# Altium schematic sheet 电梯原理图.SchDoc
size A4
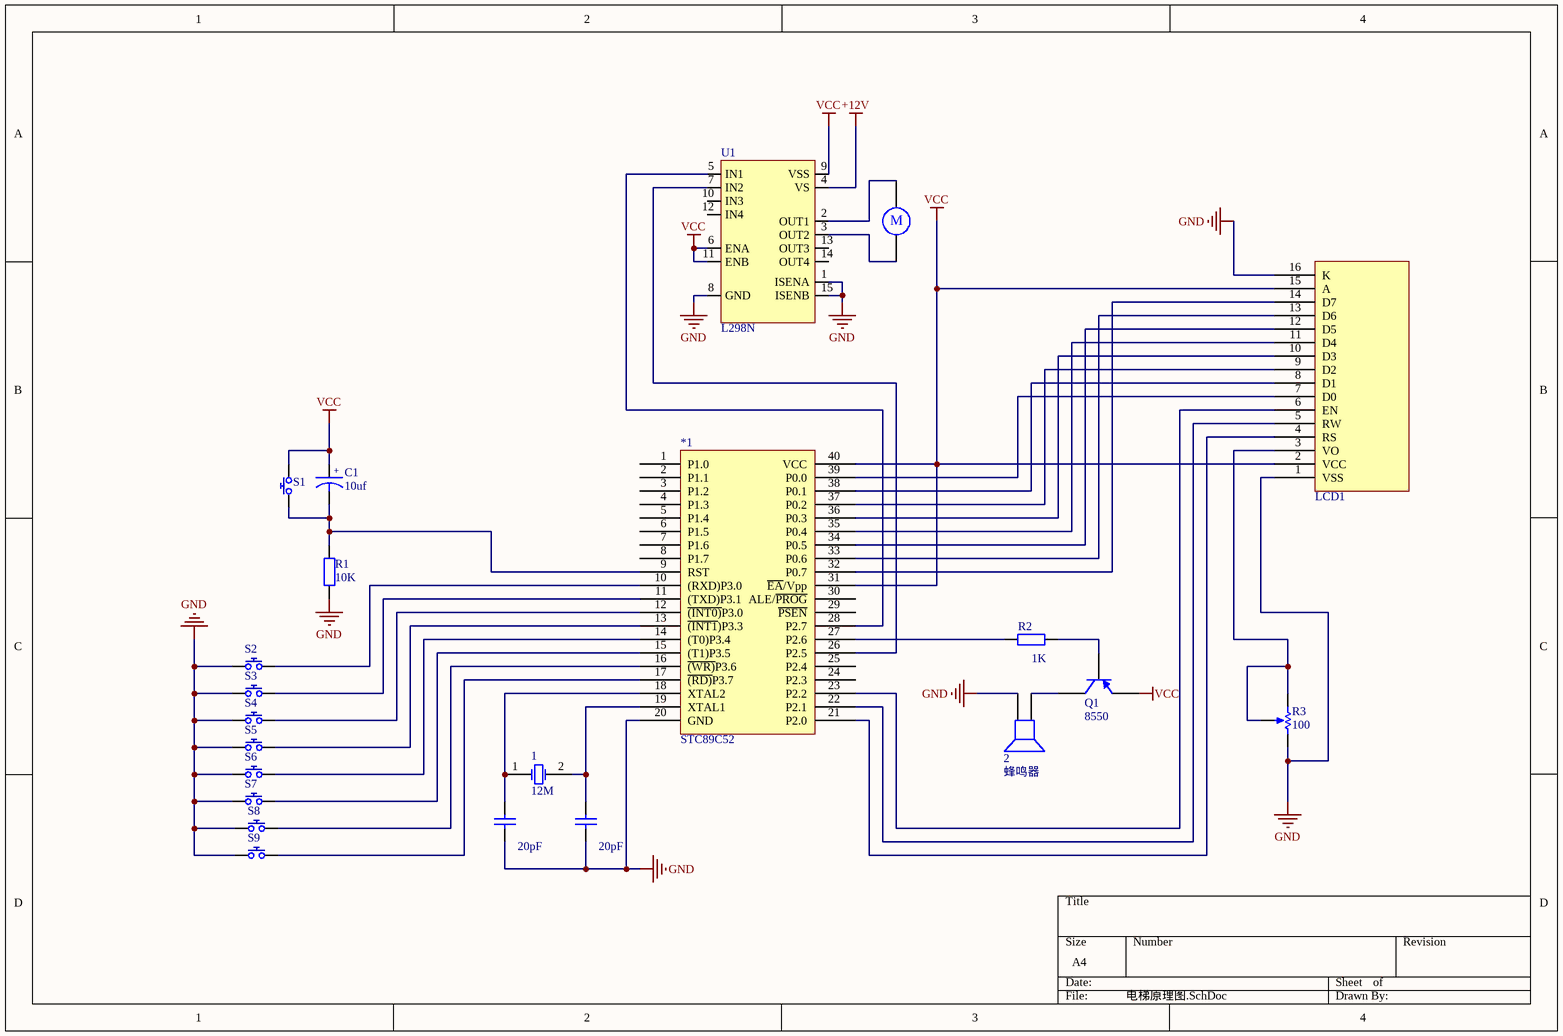
[diagram p0: 电梯原理图.SchDoc]

## Parts
1  12M  [BCY-W2/D3.1]
2  蜂鸣器  [PIN2]
*1  STC89C52
B1  Motor  [RB5-10.5]  (value not drawn)
C1  10uf  [RB.3/.6]
C2  value 20pF  [RAD-0.3]  (hidden comment: Cap)
C3  value 20pF  [RAD-0.3]  (hidden comment: Cap)
LCD1  Component_1  (value not drawn)
Q1  8550  [SOT-23B_N]
R1  10K  [R-AXIAL0.4]
R2  value 1K  [AXIAL-0.4]  (hidden comment: Res2)
R3  value 100  [VR5]  (hidden comment: RPot)
S1  (no value)  [KEY_4PIN]
S2  (no value)  [KEY_4PIN]
S3  (no value)  [KEY_4PIN]
S4  (no value)  [KEY_4PIN]
S5  (no value)  [KEY_4PIN]
S6  (no value)  [KEY_4PIN]
S7  (no value)  [KEY_4PIN]
S8  (no value)  [KEY_4PIN]
S9  (no value)  [KEY_4PIN]
U1  L298N  [L298N]

## Nets
+12V: U1.4(VS)
GND: 2.2 *1.20(GND) C2.1 C3.1 LCD1.1(VSS) LCD1.16(K) R1.1 R3.2(BOT) S2.1 S3.1 S4.1 S5.1 S6.1 S7.1 S8.1 S9.1 U1.1(ISENA) U1.8(GND) U1.15(ISENB)
VCC: *1.31(~{EA}/Vpp) *1.40(VCC) C1.1 LCD1.2(VCC) LCD1.15(A) Q1.3(E) S1.2 U1.6(ENA) U1.9(VSS) U1.11(ENB)
Net1_1: 1.1(OSC1) *1.18(XTAL2) C2.2
Net1_2: 1.2(OSC2) *1.19(XTAL1) C3.2
Net2_1: 2.1 Q1.1(C)
Net*1_9: *1.9(RST) C1.2 R1.2 S1.1
Net*1_10: *1.10((RXD)P3.0) S2.2
Net*1_11: *1.11((TXD)P3.1) S3.2
Net*1_12: *1.12(~{(INT0)}P3.0) S4.2
Net*1_13: *1.13(~{(INT1})P3.3) S5.2
Net*1_14: *1.14((T0)P3.4) S6.2
Net*1_15: *1.15((T1)P3.5) S7.2
Net*1_16: *1.16(~{(WR)}P3.6) S8.2
Net*1_17: *1.17(~{(RD)}P3.7) S9.2
Net*1_21: *1.21(P2.0) LCD1.4(RS)
Net*1_22: *1.22(P2.1) LCD1.5(RW)
Net*1_23: *1.23(P2.2) LCD1.6(EN)
Net*1_26: *1.26(P2.5) U1.7(IN2)
Net*1_27: *1.27(P2.6) R2.1
Net*1_28: *1.28(P2.7) U1.5(IN1)
Net*1_32: *1.32(P0.7) LCD1.14(D7)
Net*1_33: *1.33(P0.6) LCD1.13(D6)
Net*1_34: *1.34(P0.5) LCD1.12(D5)
Net*1_35: *1.35(P0.4) LCD1.11(D4)
Net*1_36: *1.36(P0.3) LCD1.10(D3)
Net*1_37: *1.37(P0.2) LCD1.9(D2)
Net*1_38: *1.38(P0.1) LCD1.8(D1)
Net*1_39: *1.39(P0.0) LCD1.7(D0)
NetB1_1: B1.1 U1.2(OUT1)
NetB1_2: B1.2 U1.3(OUT2)
NetLCD1_3: LCD1.3(VO) R3.1(TOP) R3.3(TAP)
NetQ1_2: Q1.2(B) R2.2

Not connected (* = marked no-connect by the designer): *1 1(P1.0) 2(P1.1) 3(P1.2) 4(P1.3) 5(P1.4) 6(P1.5) 7(P1.6) 8(P1.7) 24(P2.3) 25(P2.4) 29(~{PSEN}) 30(ALE/~{PROG}); U1 10(IN3) 12(IN4) 13(OUT3) 14(OUT4)

## Notes on the sheet
- (in symbol CAP-T) +
- (in symbol Motor) M

## Library data of the parts
1 = XTAL: Crystal Oscillator; Published: 8-Jun-2000; LatestRevisionDate: 17-Jul-2002; LatestRevisionNote: Re-released for DXP Platform.; PackageReference: R38; Publisher: Altium Limited
2 = Speaker: Loudspeaker; Published: 24-Mar-1999; LatestRevisionDate: 17-Jul-2002; LatestRevisionNote: Re-released for DXP Platform.; PackageReference: PIN2; Publisher: Altium Limited
*1 = Component_1
B1 = Motor: Motor, General Kind; Published: 24-Mar-1999; LatestRevisionDate: 17-Jul-2002; LatestRevisionNote: Re-released for DXP Platform.; PackageReference: RB5-10.5; Publisher: Altium Limited
C1 = CAP-T: 电解电容
C2 C3 = Cap: Capacitor; Published: 8-Jun-2000; LatestRevisionDate: 17-Jul-2002; LatestRevisionNote: Re-released for DXP Platform.; PackageReference: RAD-0.3; Publisher: Altium Limited
Q1 = PNP: PNP Bipolar Transistor; Published: 8-Jun-2000; LatestRevisionDate: 29-May-2009; LatestRevisionNote: IPC-7351 Footprint Added.; PackageVersion: Aug-1999; PackageReference: SOT-23B; Publisher: Altium Limited; PackageDescription: 3-Pin SOT-23 Package 0.95 mm Pitch, 2.4 mm Lead Span
R1 = RES: 插件电阻
R2 = Res2: Resistor; Published: 8-Jun-2000; LatestRevisionDate: 17-Jul-2002; LatestRevisionNote: Re-released for DXP Platform.; PackageReference: AXIAL-0.4; Publisher: Altium Limited; PackageDescription: Axial Device, Thru-Hole; 2 Leads; 0.4 in Pin Spacing
R3 = RPot: Potentiometer; Sim Note: Enter the Resistance value and the set point into parameter fields.; Set Position: 0.5; Published: 8-Jun-2000; LatestRevisionDate: 17-Jul-2002; LatestRevisionNote: Re-released for DXP Platform.; PackageReference: VR5; Publisher: Altium Limited
S1-S9 = Key: 按键开关